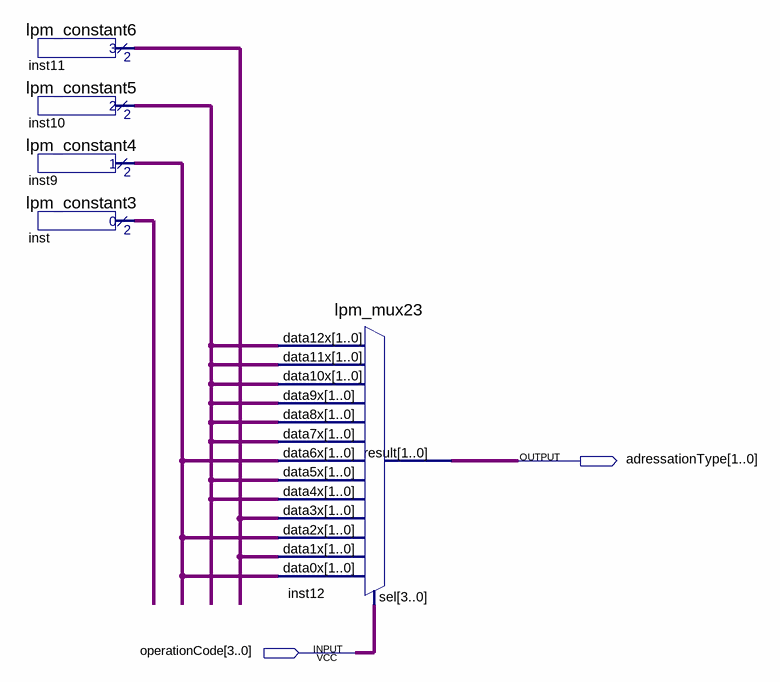
[diagram p0: schematic sheet]
// Quartus schematic chooseAdressingType.bdf as structural Verilog: 5 symbols, 2 pins
module chooseAdressingType (
  input  [3:0] operationCode,
  output [1:0] adressationType
);

  wire [1:0] inst9_result, inst10_result, inst11_result, inst_result;

  lpm_constant6 inst11 (.result(inst11_result));
  lpm_constant5 inst10 (.result(inst10_result));
  lpm_constant4 inst9 (.result(inst9_result));
  lpm_constant3 inst (.result(inst_result));
  lpm_mux23 inst12 (
    .data12x(inst10_result), .data11x(inst10_result), .data10x(inst10_result), .data9x(inst10_result),
    .data8x(inst10_result), .data7x(inst10_result), .data6x(inst9_result), .data5x(inst10_result),
    .data4x(inst10_result), .data3x(inst11_result), .data2x(inst9_result), .data1x(inst11_result),
    .data0x(inst9_result), .sel(operationCode), .result(adressationType));
endmodule
